# EAGLE design chain-light (EAGLE 5.11)
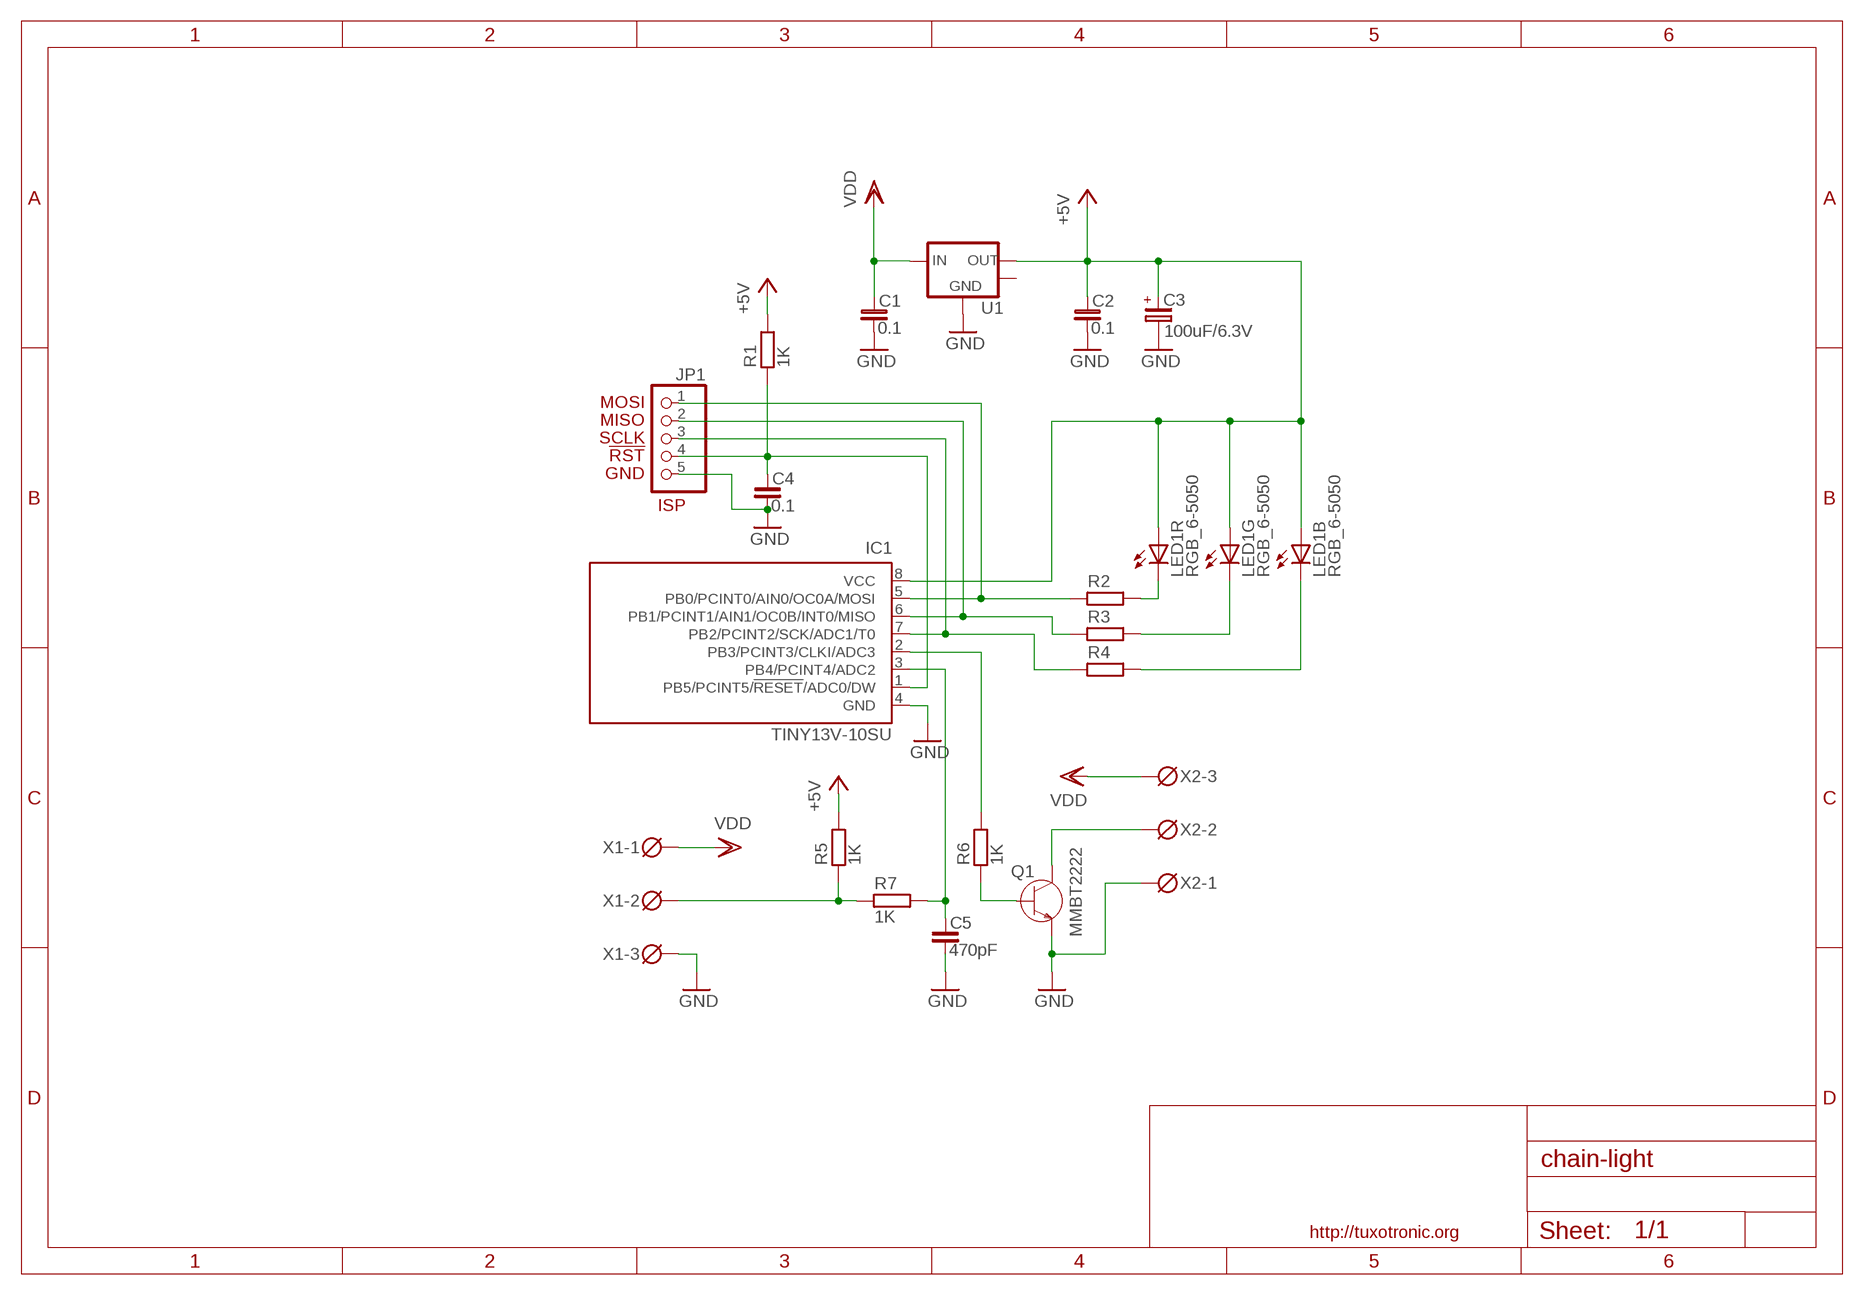
[diagram p0: schematic, sheet 1]

## Parts
C1  0.1  C_0805  [C0805]
C2  0.1  C_0805  [C0805]
C3  100uF/6.3V  CP_SMCB  [SMC_B]
C4  0.1  C_0603  [C0603]
C5  470pF  C_0603  [C0603]
IC1  TINY13V-10SU  [8S2]
JP1  PINHD-1X5_2.00  [1X05M]
LED1  RGB_6-5050  [5050_PLCC6]
Q1  MMBT2222  [SOT23]
R1  1K  R_0603  [R0603]
R2  R_0603  [R0603]
R3  R_0603  [R0603]
R4  R_0603  [R0603]
R5  1K  R_0603  [R0603]
R6  1K  R_0603  [R0603]
R7  1K  R_0603  [R0603]
U1  LM1117-5.0  [SOT223]
X1  DG3XX-03-3.5  [DG350-3.5-03P]
X2  DG3XX-03-3.5  [DG350-3.5-03P]

## Nets
+5V: C2.1 C3.+ IC1.8(VCC) LED1.1(R:A) LED1.2(G:A) LED1.3(B:A) R1.2 R5.2 U1.2(OUT)
GND: C1.2 C2.2 C3.- C4.2 C5.2 IC1.4(GND) JP1.5 Q1.2(E) U1.1(GND) X1.3 X2.1
N$1: LED1.6(R:C) R2.2
N$2: LED1.5(G:C) R3.2
N$3: LED1.4(B:C) R4.2
N$4: IC1.5(PB0/PCINT0/AIN0/OC0A/MOSI) JP1.1 R2.1
N$5: IC1.6(PB1/PCINT1/AIN1/OC0B/INT0/MISO) JP1.2 R3.1
N$6: IC1.7(PB2/PCINT2/SCK/ADC1/T0) JP1.3 R4.1
N$7: C4.1 IC1.1(PB5/PCINT5/!RESET!/ADC0/DW) JP1.4 R1.1
N$9: R5.1 R7.1 X1.2
N$10: C5.1 IC1.3(PB4/PCINT4/ADC2) R7.2
N$11: Q1.1(B) R6.1
N$12: IC1.2(PB3/PCINT3/CLKI/ADC3) R6.2
N$13: Q1.3(C) X2.2
VDD: C1.1 U1.3(IN) X1.1 X2.3
Unconnected: U1.4(MASS)

## Notes on the sheet
- MOSI
- MISO
- SCLK
- !RST
- GND
- ISP

## Library data of the parts
C1 C2 C4 C5 = rc-master-smd:C_: NON-POLARIZED CAP
C3 = rc-master-smd:CP_: POLARIZED CAP
IC1 = avr:TINY13: 8-bit AVR Microcontroller with 1K Bytes In-System Programmable Flash Source: http://www.atmel.com/dyn/resources/prod_documents/2535S.pdf
JP1 = pinhead-fixdrills:PINHD-1X5: PIN HEADER
LED1 = led:RGB_6: RGB LED 6000mcd http://tuxotronic.org/mirror/led_rgb/
Q1 = semiconductor:MMBT2222: General Purpose Transistors NPN Silicon Rating MMBT2222LT1G MMBT2222ALT1G Collector-Emitter Voltage (VCEO) 30 Vdc 40 Vdc Collector-Base Voltage (VCBO) 60 Vdc 75 Vdc Emitter-Base Voltage (VEBO) 5.0 Vdc 6.0 Vdc Collector Current Continuous (IC) 600 mAdc 1100 mAdc Collector Current Peak (ICM) 600 mAdc 1100 mAdc
R1-R7 = rc-master-smd:R_: RESISTOR
U1 = vreg-linear:LM1117: Linear regulators
X1 X2 = degson:DG3XX-03: DG350-3.5-03P DG306-5.0-03P

## Board
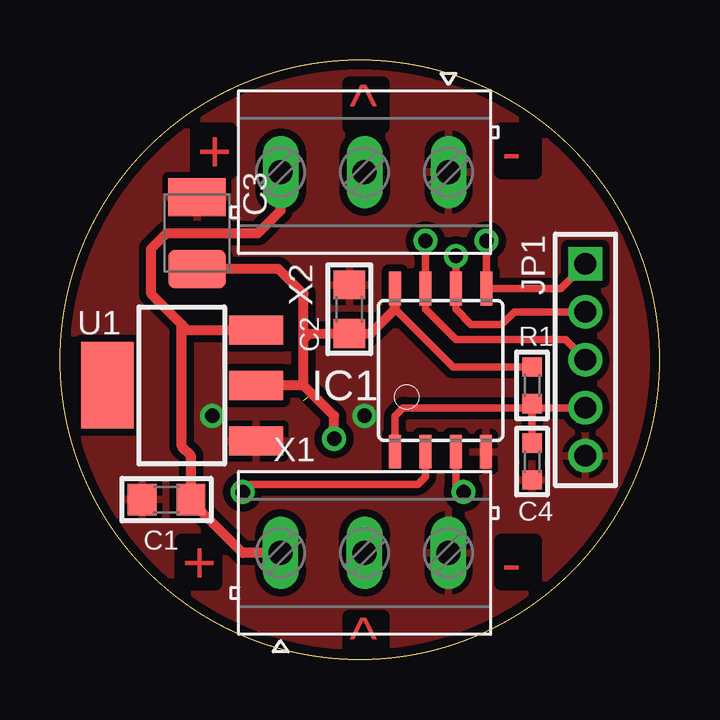
[diagram p1: board, top side]
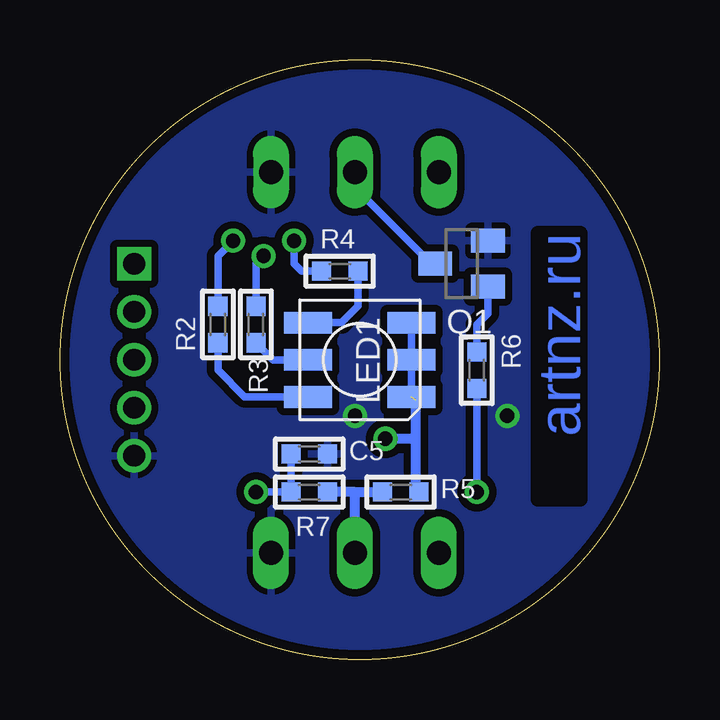
[diagram p2: board, bottom side, seen from below]

Size 25 x 25 mm. Coordinates in mm from the lower left corner, seen from the top.
Outline: circle at 12.5,12.5 radius 12.5
Copper layers (1*16): Top 0.035mm / dielectric 1.5mm / Bottom 0.035mm
Design rules "default *": minimum track width 10mil, minimum drill 24mil, track to track 8mil, track to pad 8mil, pad to pad 8mil, via to via 8mil, smd to smd 8mil, copper to edge 0.4mm, drill to drill 8mil, minimum pad ring 10mil, minimum via ring 8mil, stop-mask expansion 4mil, vias tented up to drill 0mil, thermal gap 10mil

### Footprints (pad centres in the part's own frame; a part is rotated, then mirrored left to right if it is on the bottom)
C0805 = smd 1.2 x 1.3: 1 -1.016,0; 2 1.016,0
SMC_B = smd 1.6 x 2.4: + -1.5,0; - 1.5,0
C0603 = smd 0.8 x 0.8: 1 -0.762,0; 2 0.762,0
8S2 = smd 0.5 x 1.4: 1 -1.905,-3.404; 2 -0.645,-3.404; 3 0.625,-3.404; 4 1.895,-3.404; 5 1.905,3.404; 6 0.635,3.404; 7 -0.635,3.404; 8 -1.905,3.404
1X05M = drill 0.9 square: 1 -4,0 | drill 0.9 round: 2 -2,0; 3 0,0; 4 2,0; 5 4,0
5050_PLCC6 = smd 2 x 0.9: 1 -2.15,1.55; 2 -2.15,0; 3 -2.15,-1.55; 4 2.15,-1.55; 5 2.15,0; 6 2.15,1.55
SOT23 = smd 1 x 1.4: 1 -0.95,-1.1; 2 0.95,-1.1; 3 0,1.1
R0603 = smd 0.8 x 0.8: 1 -0.762,0; 2 0.762,0
SOT223 = smd 1.219 x 2.235: 1 -2.311,-3.099; 2 0,-3.099; 3 2.311,-3.099 | smd 3.6 x 2.2: 4 0,3.099
DG350-3.5-03P = drill 1 long: 1 -3.5,0; 2 0,0; 3 3.5,0

### Placement (x,y rotation side)
C1  4.45,6.67 180 top
C2  12.06,14.61 90 top
C3  5.71,17.78 90 top
C4  19.68,8.26 270 top
C5  14.61,8.57 0 bottom
IC1  15.88,12.06 0 top
JP1  21.91,12.5 270 top
LED1  12.5,12.5 180 bottom
Q1  8.26,16.51 90 bottom
R1  19.68,11.43 90 top
R2  18.41,13.97 270 bottom
R3  16.83,13.97 270 bottom
R4  13.34,16.19 0 bottom
R5  10.79,6.99 0 bottom
R6  7.62,12.06 270 bottom
R7  14.61,6.99 180 bottom
U1  5.08,11.43 90 top
X1  12.7,4.45 0 top
X2  12.7,20.32 180 top

### Tracks (layer width: path | path; a pad name or v marks a point on that pad's centre or on a via)
+5V  (via drill 0.6)  (1 unrouted)
  Top 0.305: R1.2 16.38,12.19 13.97,14.61
  Top 0.406: IC1.8 13.97,14.61 12.95,13.59 C2.1 10.41,13.59 10.16,13.34 | v11.43,9.21 11.43,10.16 10.16,11.43 | 10.16,11.43 U1.2 | 10.16,11.43 10.16,13.34 | C3.+ 9.12,16.28 10.16,15.24 10.16,13.34
  Bottom 0.305: LED1.3 LED1.2 LED1.1
  Bottom 0.406: LED1.1 10.51,10.79 | R5.2 10.16,7.11 10.16,9.21 | 10.16,9.21 10.16,10.79 | 10.16,9.21 v11.43,9.21
GND  (via drill 0.6)
  other vias: 12.7,10.16 6.35,10.16
  pour Top (isolate 0.305): -0.64,-0.64 25.4,-0.64 25.4,25.4 -0.64,25.4
  pour Bottom (isolate 0.305): -0.64,-0.64 25.4,-0.64 25.4,25.4 -0.64,25.4
N$1
  Bottom 0.305: R2.2 18.41,12.06 17.3,10.95 LED1.6
N$2
  Bottom 0.305: LED1.5 16.12,12.5 R3.2
N$3
  Bottom 0.305: LED1.4 13.26,14.05 12.57,14.73 R4.2
N$4  (via drill 0.6)
  Top 0.305: JP1.1 20.88,15.47 IC1.5 v17.78,17.46
  Bottom 0.305: R2.1 18.41,16.83 v17.78,17.46
N$5  (via drill 0.6)
  Top 0.305: JP1.2 18.95,14.5 18.41,13.97 17.14,13.97 16.51,14.61 IC1.6 v16.51,16.83
  Bottom 0.305: R3.1 16.83,16.51 v16.51,16.83
N$6  (via drill 0.6)
  Top 0.305: JP1.3 21.07,13.34 16.51,13.34 15.24,14.61 IC1.7 v15.24,17.46
  Bottom 0.305: R4.1 14.92,16.19 15.24,16.51 v15.24,17.46
N$7
  Top 0.305: 19.68,10.5 14.31,10.5 13.97,10.16 IC1.1 | 19.68,10.5 JP1.4 | 19.68,10.5 C4.1 | 19.68,10.5 R1.1
N$9
  Bottom 0.406: 12.7,6.99 R5.1 | 12.7,6.99 R7.1 | X1.2 12.7,6.99
N$10  (via drill 0.6)
  Top 0.305: v16.83,6.99 16.51,7.3 IC1.3
  Bottom 0.305: v16.83,6.99 R7.2 C5.1
N$11
  Bottom 0.305: Q1.1 7.16,14.44 7.62,13.97 R6.1
N$12  (via drill 0.6)
  Top 0.305: IC1.2 15.23,7.61 14.92,7.3 7.94,7.3 v7.62,6.99
  Bottom 0.305: v7.62,6.99 R6.2
N$13
  Bottom 0.305: Q1.3 9.53,16.51 12.7,19.68 X2.2
VDD
  Top 0.406: X1.1 7.62,4.45 5.46,6.6 C1.1 5.46,8.51 5.08,8.89 5.08,13.97 | U1.3 5.31,13.74 5.08,13.97 | X2.3 9.2,18.73 8.26,17.78 4.45,17.78 3.81,17.14 3.81,15.24 5.08,13.97

### Text on the board
Top: ^ | + | - | + | - | ^
Bottom: artnz.ru